# Altium schematic sheet Sunboost.SchDoc
size A3; Organization: Altium Limited; Address1: L3, 12a Rodborough Rd; Address2: Frenchs Forest; Address3: NSW; Address4: Australia 2086
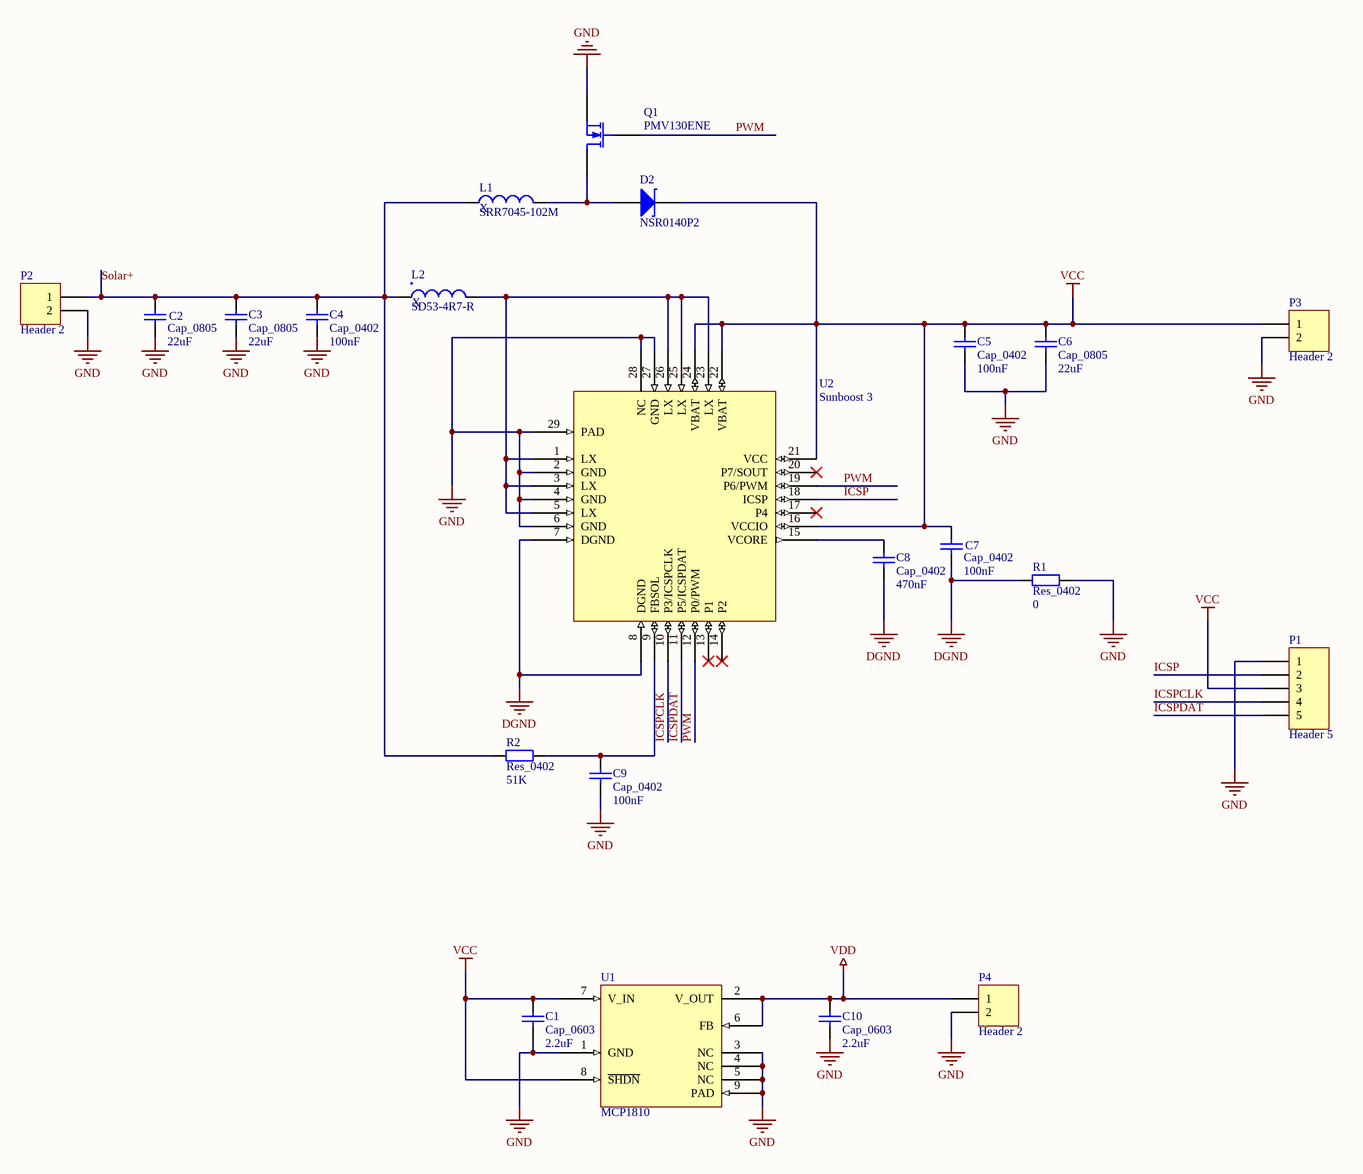
[diagram p0: Sunboost.SchDoc]

## Parts
C1  Cap_0603  value 2.2uF  [0603]
C2  Cap_0805  value 22uF  [0805]
C3  Cap_0805  value 22uF  [0805]
C4  Cap_0402  value 100nF  [0402]
C5  Cap_0402  value 100nF  [0402]
C6  Cap_0805  value 22uF  [0805]
C7  Cap_0402  value 100nF  [0402]
C8  Cap_0402  value 470nF  [0402]
C9  Cap_0402  value 100nF  [0402]
C10  Cap_0603  value 2.2uF  [0603]
D2  NSR0140P2  [SOD-923]
L1  SRR7045-102M  value X  [SRR7045-102M]
L2  SD53-4R7-R  value X  [SD53-4R7-R]
P1  Header 5  [HDR1X5]
P2  Header 2  [HDR1X2]
P3  Header 2  [HDR1X2]
P4  Header 2  [HDR1X2]
Q1  PMV130ENE  [SOT-23]
R1  Res_0402  value 0  [0402]
R2  Res_0402  value 51K  [0402]
U1  MCP1810  [VDFN8]
U2  Sunboost 3  [28-QFN_0.4mm]

## Nets
DGND: C7.1 C8.1 R1.1 U2.7(DGND) U2.8(DGND)
GND: C1.1 C2.1 C3.1 C4.1 C5.1 C6.1 C9.1 C10.1 P1.1 P2.2 P3.2 P4.2 Q1.2(S) R1.2 U1.1(GND) U1.3(NC) U1.4(NC) U1.5(NC) U1.9(PAD) U2.2(GND) U2.4(GND) U2.6(GND) U2.27(GND) U2.28(NC) U2.29(PAD)
VCC: C1.2 C5.2 C6.2 C7.2 D2.1(K) P1.3 P3.1 U1.7(V_IN) U1.8(~{SHDN}) U2.16(VCCIO) U2.21(VCC) U2.22(VBAT) U2.24(VBAT)
VDD: C10.2 P4.1 U1.2(V_OUT) U1.6(FB)
ICSP: P1.2 U2.18(ICSP)
ICSPCLK: P1.4 U2.10(P3/ICSPCLK)
ICSPDAT: P1.5 U2.11(P5/ICSPDAT)
PWM: Q1.1(G) U2.12(P0/PWM) U2.19(P6/PWM)
Solar+: C2.2 C3.2 C4.2 L1.1 L2.1 P2.1 R2.1
NetC8_2: C8.2 U2.15(VCORE)
NetC9_2: C9.2 R2.2 U2.9(FBSOL)
NetD2_2: D2.2(A) L1.2 Q1.3(D)
NetL2_2: L2.2 U2.1(LX) U2.3(LX) U2.5(LX) U2.23(LX) U2.25(LX) U2.26(LX)

Not connected (* = marked no-connect by the designer): U2 13(P1)* 14(P2)* 17(P4)* 20(P7/SOUT)*

## Notes on the sheet
- Title
- Size:
- Date:
- A3
- Number:
- Time:
- Revision:
- Sheet
- of
- File:

## Library data of the parts
C1 C10 = Cap_0603: Capacitor; Published: 8-Jun-2000; LatestRevisionDate: 17-Jul-2002; LatestRevisionNote: Re-released for DXP Platform.; PackageReference: RAD-0.3; Publisher: Altium Limited; PackageDescription: Radial Cap, Thru-Hole; 2 Leads; 0.3 in Pin Spacing
C2 C3 C6 = Cap_0805: Capacitor; Published: 8-Jun-2000; LatestRevisionDate: 17-Jul-2002; LatestRevisionNote: Re-released for DXP Platform.; PackageReference: RAD-0.3; Publisher: Altium Limited; PackageDescription: Radial Cap, Thru-Hole; 2 Leads; 0.3 in Pin Spacing
C4 C5 C7-C9 = Cap_0402: Capacitor; Published: 8-Jun-2000; LatestRevisionDate: 17-Jul-2002; LatestRevisionNote: Re-released for DXP Platform.; PackageReference: RAD-0.3; Publisher: Altium Limited; PackageDescription: Radial Cap, Thru-Hole; 2 Leads; 0.3 in Pin Spacing
D2 = NSR0140P2: Typical INFRARED GaAs LED; Published: 8-Jun-2000; LatestRevisionDate: 08-Jul-2005; LatestRevisionNote: Mech Layer 1 removed.; PackageReference: LED-0; Publisher: Altium Limited; PackageDescription: LED; 2 Leads
L1 = SRR7045-102M: Inductor
L2 = SD53-4R7-R: Inductor
P1 = Header 5: Header, 5-Pin; LatestRevisionDate: 17-Jul-2002; LatestRevisionNote: Re-released for DXP Platform.; Publisher: Altium Limited
P2-P4 = Header 2: Header, 2-Pin; LatestRevisionDate: 17-Jul-2002; LatestRevisionNote: Re-released for DXP Platform.; Publisher: Altium Limited
Q1 = PMV130ENE: N-Channel MOSFET; Published: 8-Jun-2000; LatestRevisionDate: 17-Jul-2002; LatestRevisionNote: Re-released for DXP Platform.; PackageVersion: 1995/1996; PackageReference: E3; Publisher: Altium Limited; PackageDescription: TO, Flat Index; 3 In-Line, Axial Leads; Body Dia. 4.6mm; Lead Dia. 0.5 mm (max)
R1 R2 = Res_0402: Resistor; Published: 8-Jun-2000; LatestRevisionDate: 17-Jul-2002; LatestRevisionNote: Re-released for DXP Platform.; PackageReference: AXIAL-0.4; Publisher: Altium Limited; PackageDescription: Axial Device, Thru-Hole; 2 Leads; 0.4 in Pin Spacing
U1 = MCP1810: 3V Regulator, 150 mA
U2 = Sunboost 3: Initvation Sunboost 3